# EAGLE schematic RelayBoard (EAGLE 6.5.0)

## Sheet 1 of 5: Power
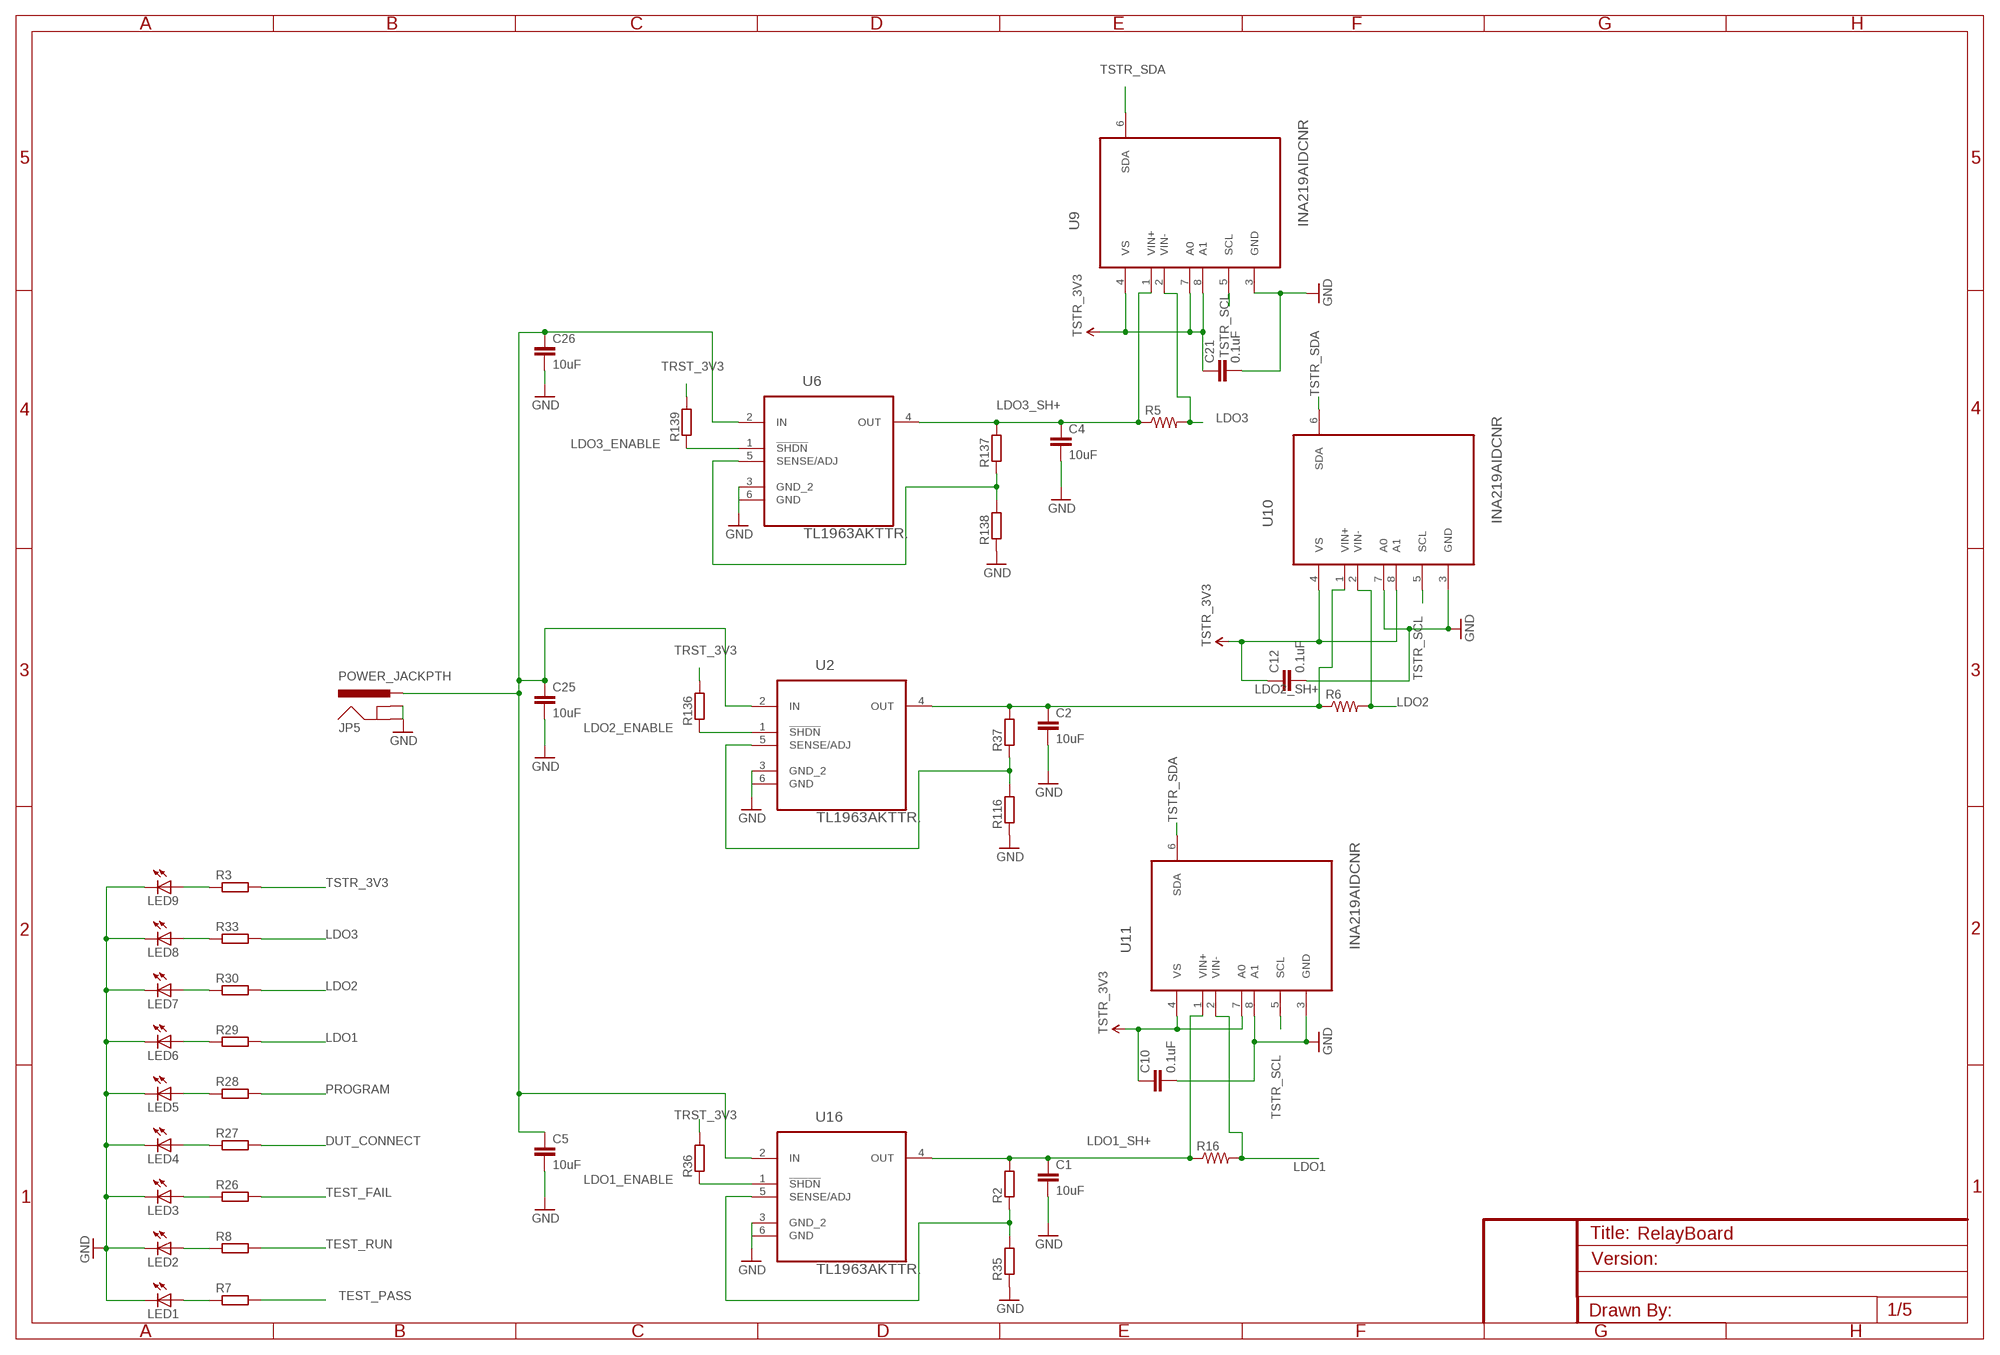
[diagram p0: schematic, sheet 1, part 1 of 2]
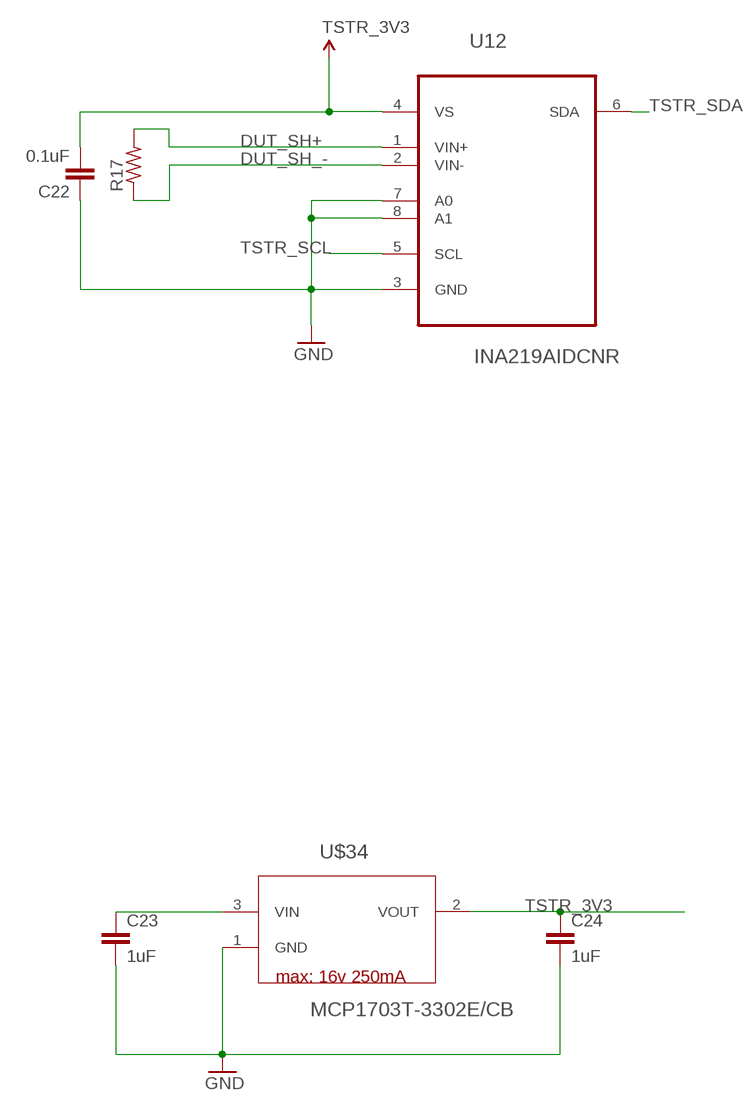
[diagram p1: schematic, sheet 1, part 2 of 2]

### Parts
C1  10uF  C-EUC0402  [C0402]
C2  10uF  C-EUC0402  [C0402]
C4  10uF  C-EUC0402  [C0402]
C5  10uF  C-EUC0402  [C0402]
C10  0.1uF  C-EUC0402  [C0402]
C12  0.1uF  C-EUC0402  [C0402]
C21  0.1uF  C-EUC0402  [C0402]
C22  0.1uF  C-EUC0402  [C0402]
C23  1uF  C-EUC0402  [C0402]
C24  1uF  C-EUC0402  [C0402]
C25  10uF  C-EUC0402  [C0402]
C26  10uF  C-EUC0402  [C0402]
JP5  POWER_JACKPTH  [POWER_JACK_PTH]
LED1  LEDCHIP-LED0805  [CHIP-LED0805]
LED2  LEDCHIP-LED0805  [CHIP-LED0805]
LED3  LEDCHIP-LED0805  [CHIP-LED0805]
LED4  LEDCHIP-LED0805  [CHIP-LED0805]
LED5  LEDCHIP-LED0805  [CHIP-LED0805]
LED6  LEDCHIP-LED0805  [CHIP-LED0805]
LED7  LEDCHIP-LED0805  [CHIP-LED0805]
LED8  LEDCHIP-LED0805  [CHIP-LED0805]
LED9  LEDCHIP-LED0805  [CHIP-LED0805]
R2  R-EU_R0402  [R0402]
R3  R-EU_R0402  [R0402]
R5  R-US_R5025  [R5025]
R6  R-US_R5025  [R5025]
R7  R-EU_R0402  [R0402]
R8  R-EU_R0402  [R0402]
R16  R-US_R5025  [R5025]
R17  R-US_R5025  [R5025]
R26  R-EU_R0402  [R0402]
R27  R-EU_R0402  [R0402]
R28  R-EU_R0402  [R0402]
R29  R-EU_R0402  [R0402]
R30  R-EU_R0402  [R0402]
R33  R-EU_R0402  [R0402]
R35  R-EU_R0402  [R0402]
R36  R-EU_R0402  [R0402]
R37  R-EU_R0402  [R0402]
R116  R-EU_R0402  [R0402]
R136  R-EU_R0402  [R0402]
R137  R-EU_R0402  [R0402]
R138  R-EU_R0402  [R0402]
R139  R-EU_R0402  [R0402]
U2  TL1963AKTTR.  [TO170P1485X457-6N]
U6  TL1963AKTTR.  [TO170P1485X457-6N]
U9  INA219AIDCNR  [SOT65P280X145-8N]
U10  INA219AIDCNR  [SOT65P280X145-8N]
U11  INA219AIDCNR  [SOT65P280X145-8N]
U12  INA219AIDCNR  [SOT65P280X145-8N]
U16  TL1963AKTTR.  [TO170P1485X457-6N]
U$34  MCP1703T-3302E/CB  [SOT95P300X145-3N]

### Nets
ADJ3: R2.1 R35.2 U16.5(SENSE/ADJ)
ADJ4: R37.1 R116.2 U2.5(SENSE/ADJ)
ADJ5: R137.1 R138.2 U6.5(SENSE/ADJ)
DUT_CONNECT: R27.2
DUT_SH+: R17.2 U12.1(VIN+)
DUT_SH_-: R17.1 U12.2(VIN-)
GND: C1.2 C2.2 C4.2 C5.2 C10.2 C12.2 C21.2 C22.1 C23.2 C24.2 C25.2 C26.2 JP5.GND JP5.GNDBREAK LED1.C LED2.C LED3.C LED4.C LED5.C LED6.C LED7.C LED8.C LED9.C R35.1 R116.1 R138.1 U2.3(GND_2) U2.6(GND) U6.3(GND_2) U6.6(GND) U9.3(GND) U10.3(GND) U10.7(A0) U11.3(GND) U11.8(A1) U12.3(GND) U12.7(A0) U12.8(A1) U16.3(GND_2) U16.6(GND) U$34.1(GND) ; also sheet 2,3,4,5
LDO1 [Power]: R16.2 R29.2 U11.2(VIN-) ; also sheet 3
LDO1_ENABLE: R36.1 U16.1(!SHDN)
LDO1_SH+ [Power]: C1.1 R2.2 R16.1 U11.1(VIN+) U16.4(OUT)
LDO2 [Power]: R6.2 R30.2 U10.2(VIN-) ; also sheet 3
LDO2_ENABLE: R136.1 U2.1(!SHDN)
LDO2_SH+ [Power]: C2.1 R6.1 R37.2 U2.4(OUT) U10.1(VIN+)
LDO3 [Power]: R5.2 R33.2 U9.2(VIN-) ; also sheet 3
LDO3_ENABLE: R139.1 U6.1(!SHDN)
LDO3_SH+ [Power]: C4.1 R5.1 R137.2 U6.4(OUT) U9.1(VIN+)
N$3: LED2.A R8.1
N$5: LED1.A R7.1
N$23: LED3.A R26.1
N$25: LED4.A R27.1
N$33: LED5.A R28.1
N$34: LED6.A R29.1
N$35: LED7.A R30.1
N$36: LED8.A R33.1
N$110: LED9.A R3.1
N$216: C23.1 U$34.3(VIN)
POWER_IN: C5.1 C25.1 C26.1 JP5.PWR U2.2(IN) U6.2(IN) U16.2(IN)
PROGRAM: R28.2
TEST_FAIL: R26.2
TEST_PASS: R7.2
TEST_RUN: R8.2
TRST_3V3: R36.2 R136.2 R139.2
TSTR_3V3: C10.1 C12.1 C21.1 C22.2 C24.1 R3.2 U9.4(VS) U9.7(A0) U9.8(A1) U10.4(VS) U10.8(A1) U11.4(VS) U11.7(A0) U12.4(VS) U$34.2(VOUT) ; also sheet 2,4
TSTR_SCL: U9.5(SCL) U10.5(SCL) U11.5(SCL) U12.5(SCL)
TSTR_SDA: U9.6(SDA) U10.6(SDA) U11.6(SDA) U12.6(SDA)

### Notes on the sheet
- max: 16v 250mA

## Sheet 2 of 5: MCU
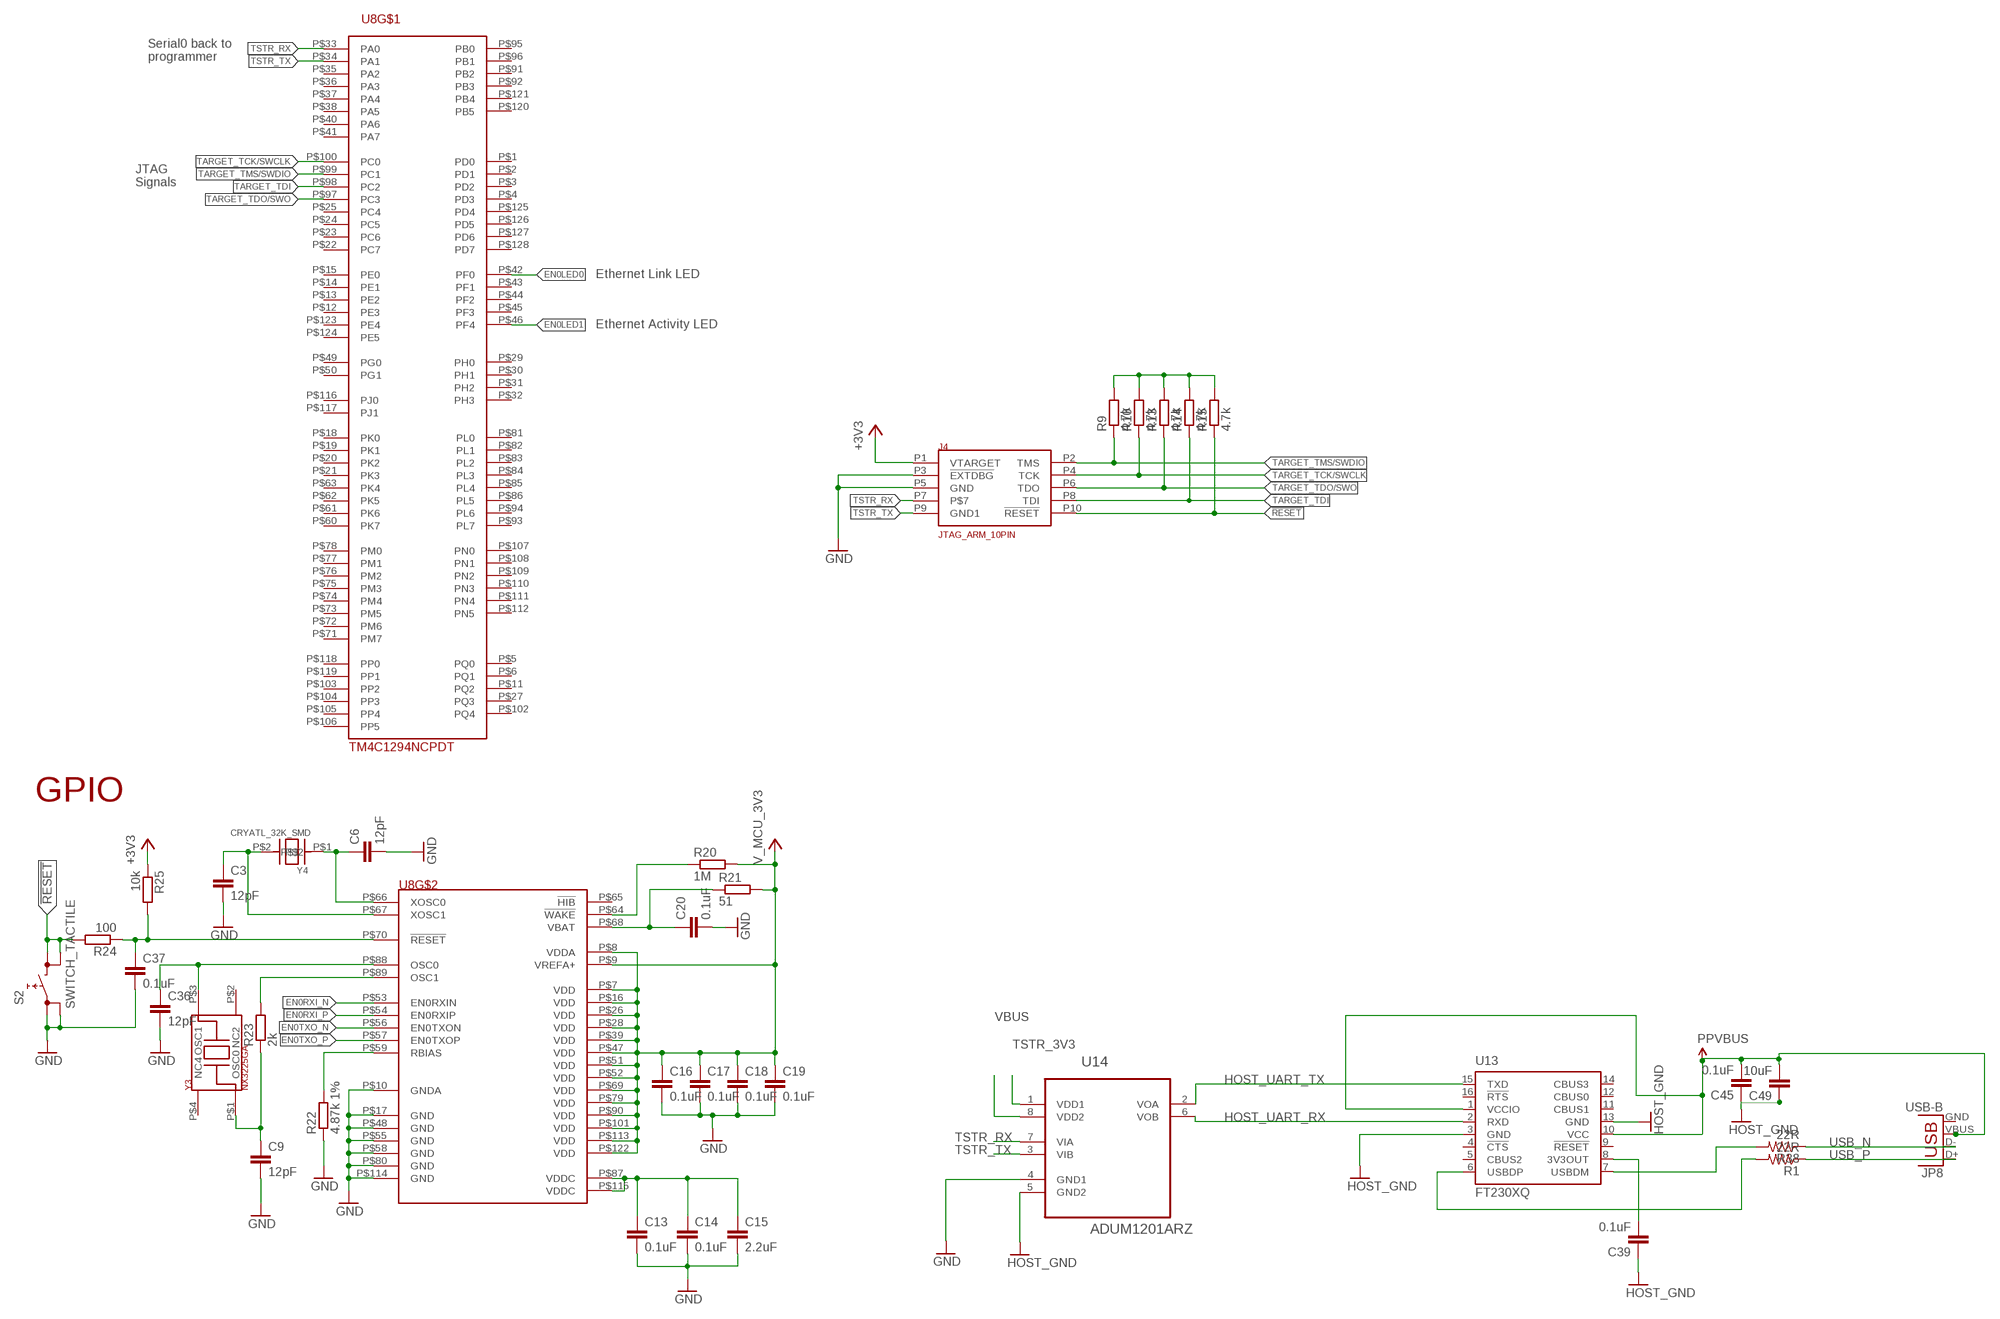
[diagram p2: schematic, sheet 2]

### Parts
C3  12pF  C-EUC0402K  [C0402K]
C6  12pF  C-EUC0402K  [C0402K]
C9  12pF  C-EUC0402K  [C0402K]
C13  0.1uF  C-EUC0402K  [C0402K]
C14  0.1uF  C-EUC0402K  [C0402K]
C15  2.2uF  C-EUC0402K  [C0402K]
C16  0.1uF  C-EUC0402K  [C0402K]
C17  0.1uF  C-EUC0402K  [C0402K]
C18  0.1uF  C-EUC0402K  [C0402K]
C19  0.1uF  C-EUC0402K  [C0402K]
C20  0.1uF  C-EUC0402K  [C0402K]
C36  12pF  C-EUC0402K  [C0402K]
C37  0.1uF  CC0402  [C0402]
C39  0.1uF  C-EUC0402  [C0402]
C45  0.1uF  C-EUC0402  [C0402]
C49  10uF  C-EUC0402  [C0402]
J4  JTAG_ARM_10PIN  [CON_2X5_50MIL]
JP8  USB-B  USBPTH  [USB-B-PTH]
R1  22R  RESISTOR0402-RES  [0402-RES]
R9  4.7k  R-EU_R0402  [R0402]
R10  4.7k  R-EU_R0402  [R0402]
R13  4.7k  R-EU_R0402  [R0402]
R14  4.7k  R-EU_R0402  [R0402]
R15  4.7k  R-EU_R0402  [R0402]
R20  1M  R-EU_R0402  [R0402]
R21  51  R-EU_R0402  [R0402]
R22  4.87k 1%  R-EU_R0402  [R0402]
R23  2k  R-EU_R0402  [R0402]
R24  100  R-EU_R0402  [R0402]
R25  10k  R-EU_R0402  [R0402]
R38  22R  RESISTOR0402-RES  [0402-RES]
S2  SWITCH_TACTILE  [SWITCH_6MM_6MM_TE_CON_SMD]
U8  TM4C1294NCPDT  [TQFP-128]
U13  FT230XQ  [QFN16]
U14  ADUM1201ARZ  [SOIC127P600X175-8N]
Y3  NX3225GA  [NDK3.2X2.5]
Y4  CRYATL_32K_SMD  [CRYSTAL_32K_SMD]

### Nets
!RESET: J4.P10(!RESET) R15.1 R24.2 S2.P$3 S2.P$4
EN0LED0: U8.P$42(PF0)
EN0LED1: U8.P$46(PF4)
EN0RXI_N [Ethernet]: U8.P$53(EN0RXIN)
EN0RXI_P [Ethernet]: U8.P$54(EN0RXIP)
EN0TXO_N [Ethernet]: U8.P$56(EN0TXON)
EN0TXO_P [Ethernet]: U8.P$57(EN0TXOP)
GND: C3.2 C6.2 C9.2 C13.2 C14.2 C15.2 C16.2 C17.2 C18.2 C19.2 C20.2 C36.2 C37.2 J4.P3(!EXTDBG) J4.P5(GND) R22.1 S2.P$1 S2.P$2 U8.P$10(GNDA) U8.P$17(GND) U8.P$48(GND) U8.P$55(GND) U8.P$58(GND) U8.P$80(GND) U8.P$114(GND) U14.4(GND1) ; also sheet 1,3,4,5
HOST_GND: C39.1 C45.1 C49.1 U13.3(GND) U13.13(GND) U14.5(GND2)
HOST_UART_RX: U13.2(RXD) U14.6(VOB)
HOST_UART_TX: U13.15(TXD) U14.2(VOA)
N$2: R9.2 R10.2 R13.2 R14.2 R15.2
N$159: C39.2 U13.8(3V3OUT)
N_$2: C20.1 R21.1 U8.P$68(VBAT)
N_$24: R20.1 U8.P$64(!WAKE)
N_$28: C13.1 C14.1 C15.1 U8.P$87(VDDC) U8.P$115(VDDC)
N_$29: R22.2 U8.P$59(RBIAS)
N_$30: R23.2 U8.P$89(OSC1)
N_$31: C36.1 U8.P$88(OSC0) Y3.P$3(OSC1)
N_$32: C9.1 R23.1 Y3.P$1(OSC0)
N_$33: C37.1 R24.1 R25.2 U8.P$70(!RESET)
N_$34: C6.1 U8.P$66(XOSC0) Y4.P$1
N_$35: C3.1 U8.P$67(XOSC1) Y4.P$2
TARGET_TCK/SWCLK: J4.P4(TCK) R10.1 U8.P$100(PC0)
TARGET_TDI: J4.P8(TDI) R14.1 U8.P$98(PC2)
TARGET_TDO/SWO: J4.P6(TDO) R13.1 U8.P$97(PC3)
TARGET_TMS/SWDIO: J4.P2(TMS) R9.1 U8.P$99(PC1)
TSTR_3V3: C16.1 C17.1 C18.1 C19.1 J4.P1(VTARGET) R20.2 R21.2 R25.1 U8.P$7(VDD) U8.P$8(VDDA) U8.P$9(VREFA+) U8.P$16(VDD) U8.P$26(VDD) U8.P$28(VDD) U8.P$39(VDD) U8.P$47(VDD) U8.P$51(VDD) U8.P$52(VDD) U8.P$69(VDD) U8.P$79(VDD) U8.P$90(VDD) U8.P$101(VDD) U8.P$113(VDD) U8.P$122(VDD) U14.1(VDD1) ; supply symbol labelled V_MCU_3V3, +3V3 ; also sheet 1,4
TSTR_RX: J4.P7 U8.P$33(PA0) U14.7(VIA) ; also sheet 4
TSTR_TX: J4.P9(GND1) U8.P$34(PA1) U14.3(VIB) ; also sheet 4
USB_N: JP8.D- R38.1
USB_P: JP8.D+ R1.1
USBD_N: R38.2 U13.7(USBDM)
USBD_P: R1.2 U13.6(USBDP)
VBUS: C45.2 C49.2 JP8.VBUS U13.1(VCCIO) U13.10(VCC) U14.8(VDD2) ; supply symbol labelled PPVBUS
Unconnected: JP8.GND U8.P$1(PD0) U8.P$2(PD1) U8.P$3(PD2) U8.P$4(PD3) U8.P$5(PQ0) U8.P$6(PQ1) U8.P$11(PQ2) U8.P$12(PE3) U8.P$13(PE2) U8.P$14(PE1) U8.P$15(PE0) U8.P$18(PK0) U8.P$19(PK1) U8.P$20(PK2) U8.P$21(PK3) U8.P$22(PC7) U8.P$23(PC6) U8.P$24(PC5) U8.P$25(PC4) U8.P$27(PQ3) U8.P$29(PH0) U8.P$30(PH1) U8.P$31(PH2) U8.P$32(PH3) U8.P$35(PA2) U8.P$36(PA3) U8.P$37(PA4) U8.P$38(PA5) U8.P$40(PA6) U8.P$41(PA7) U8.P$43(PF1) U8.P$44(PF2) U8.P$45(PF3) U8.P$49(PG0) U8.P$50(PG1) U8.P$60(PK7) U8.P$61(PK6) U8.P$62(PK5) U8.P$63(PK4) U8.P$65(!HIB) U8.P$71(PM7) U8.P$72(PM6) U8.P$73(PM5) U8.P$74(PM4) U8.P$75(PM3) U8.P$76(PM2) U8.P$77(PM1) U8.P$78(PM0) U8.P$81(PL0) U8.P$82(PL1) U8.P$83(PL2) U8.P$84(PL3) U8.P$85(PL4) U8.P$86(PL5) U8.P$91(PB2) U8.P$92(PB3) U8.P$93(PL7) U8.P$94(PL6) U8.P$95(PB0) U8.P$96(PB1) U8.P$102(PQ4) U8.P$103(PP2) U8.P$104(PP3) U8.P$105(PP4) U8.P$106(PP5) U8.P$107(PN0) U8.P$108(PN1) U8.P$109(PN2) U8.P$110(PN3) U8.P$111(PN4) U8.P$112(PN5) U8.P$116(PJ0) U8.P$117(PJ1) U8.P$118(PP0) U8.P$119(PP1) U8.P$120(PB5) U8.P$121(PB4) U8.P$123(PE4) U8.P$124(PE5) U8.P$125(PD4) U8.P$126(PD5) U8.P$127(PD6) U8.P$128(PD7) U13.4(!CTS) U13.5(CBUS2) U13.9(!RESET) U13.11(CBUS1) U13.12(CBUS0) U13.14(CBUS3) U13.16(!RTS) Y3.P$2(NC2) Y3.P$4(NC4)

### Notes on the sheet
- Serial0 back to
  programmer
- JTAG
  Signals
- Ethernet Link LED
- Ethernet Activity LED
- GPIO

## Sheet 3 of 5: DUT_Connector
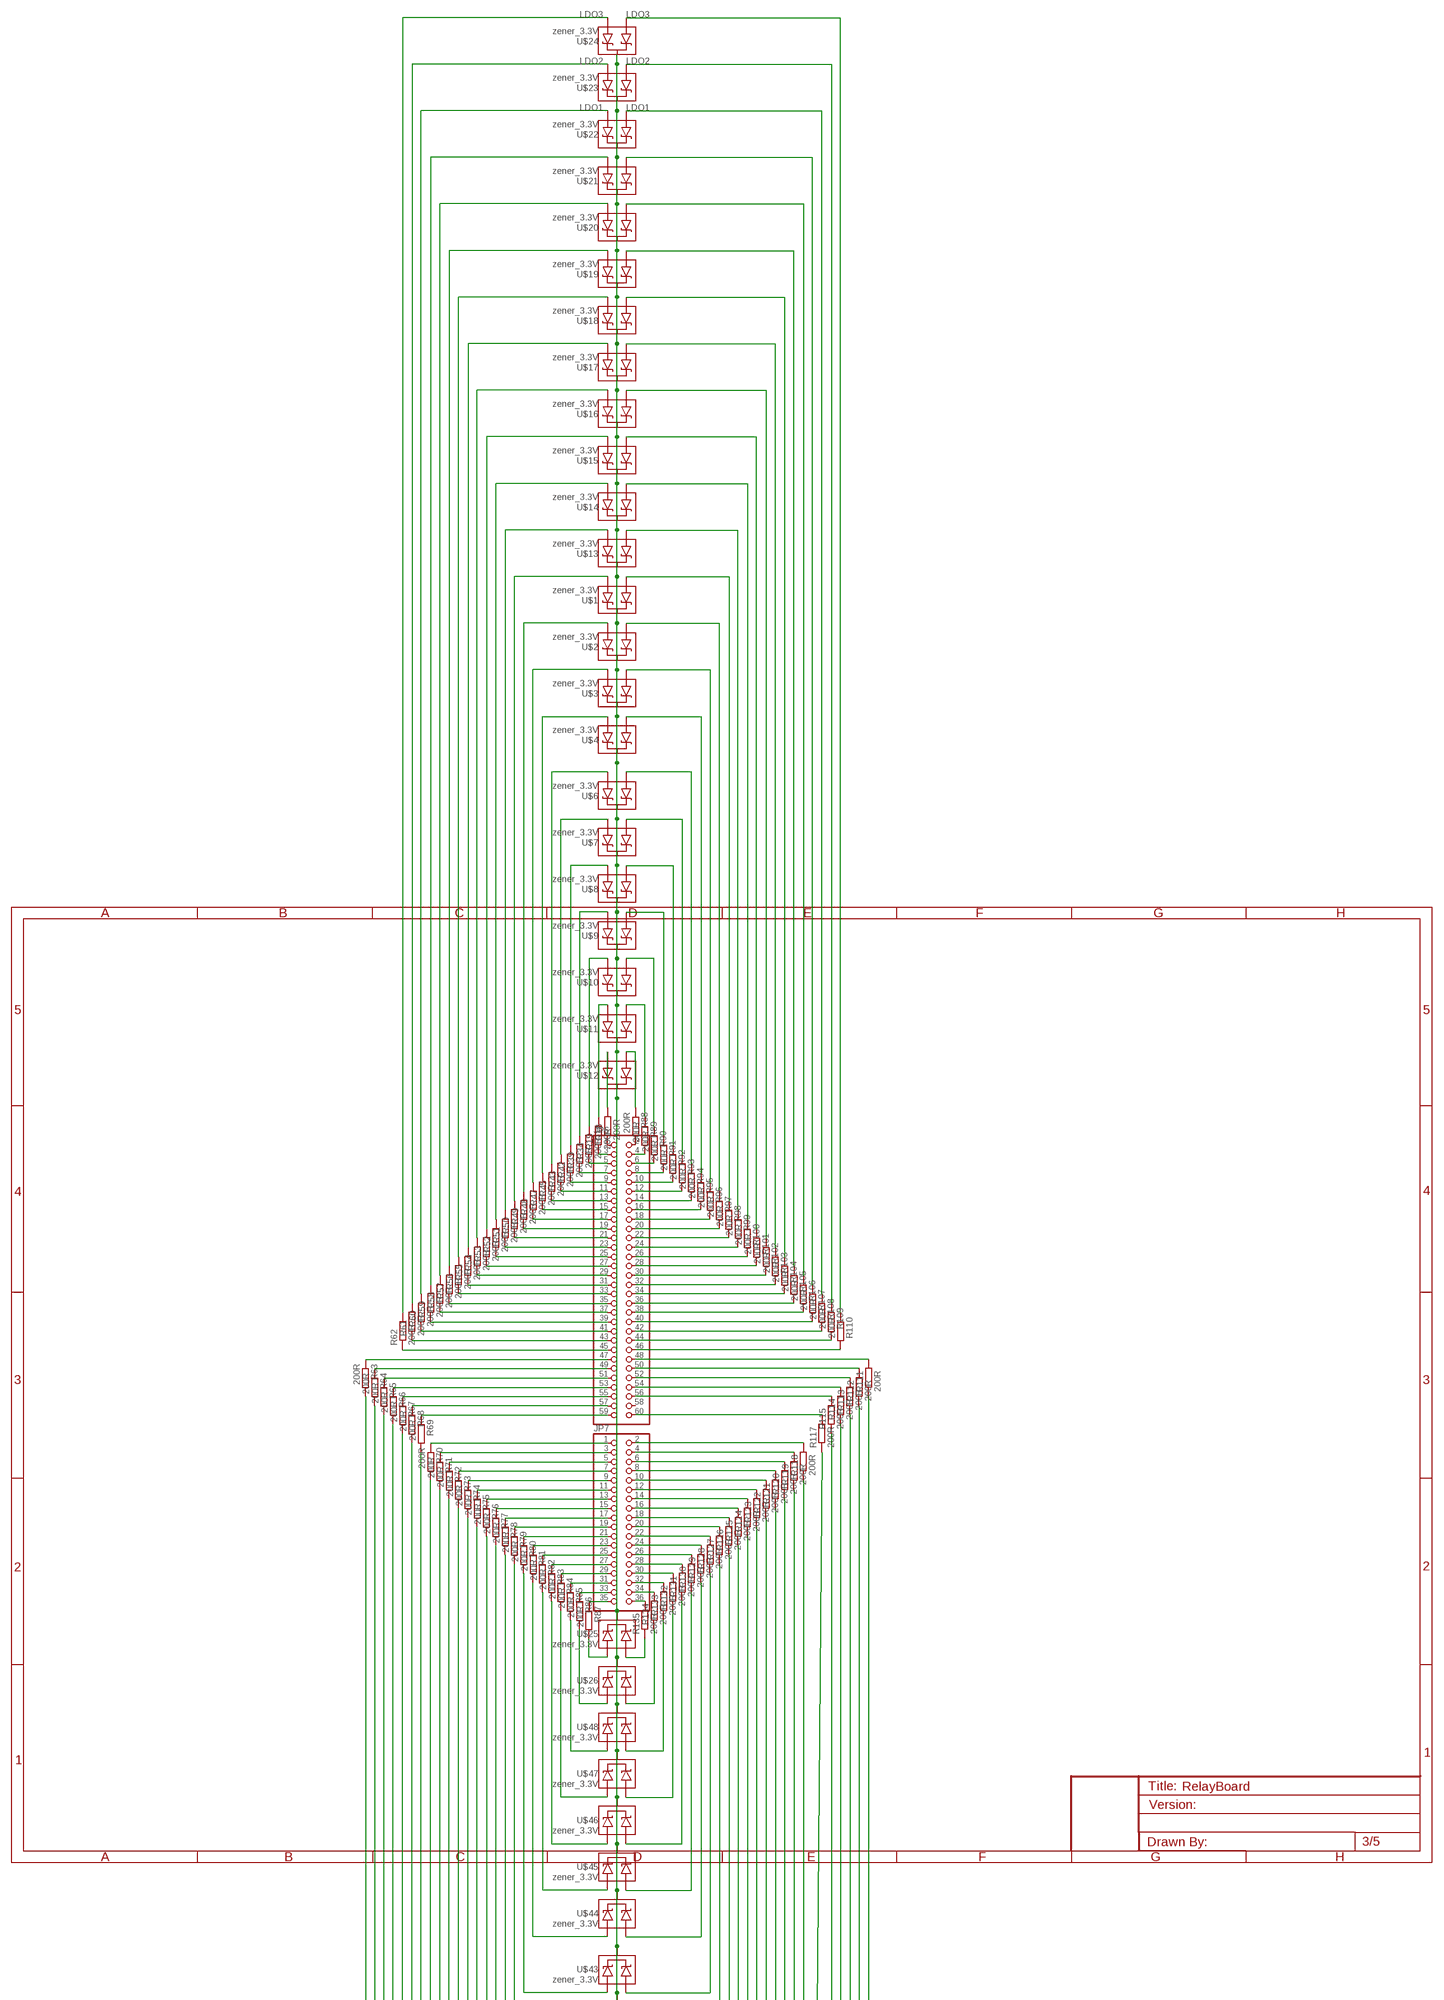
[diagram p3: schematic, sheet 3, part 1 of 2]
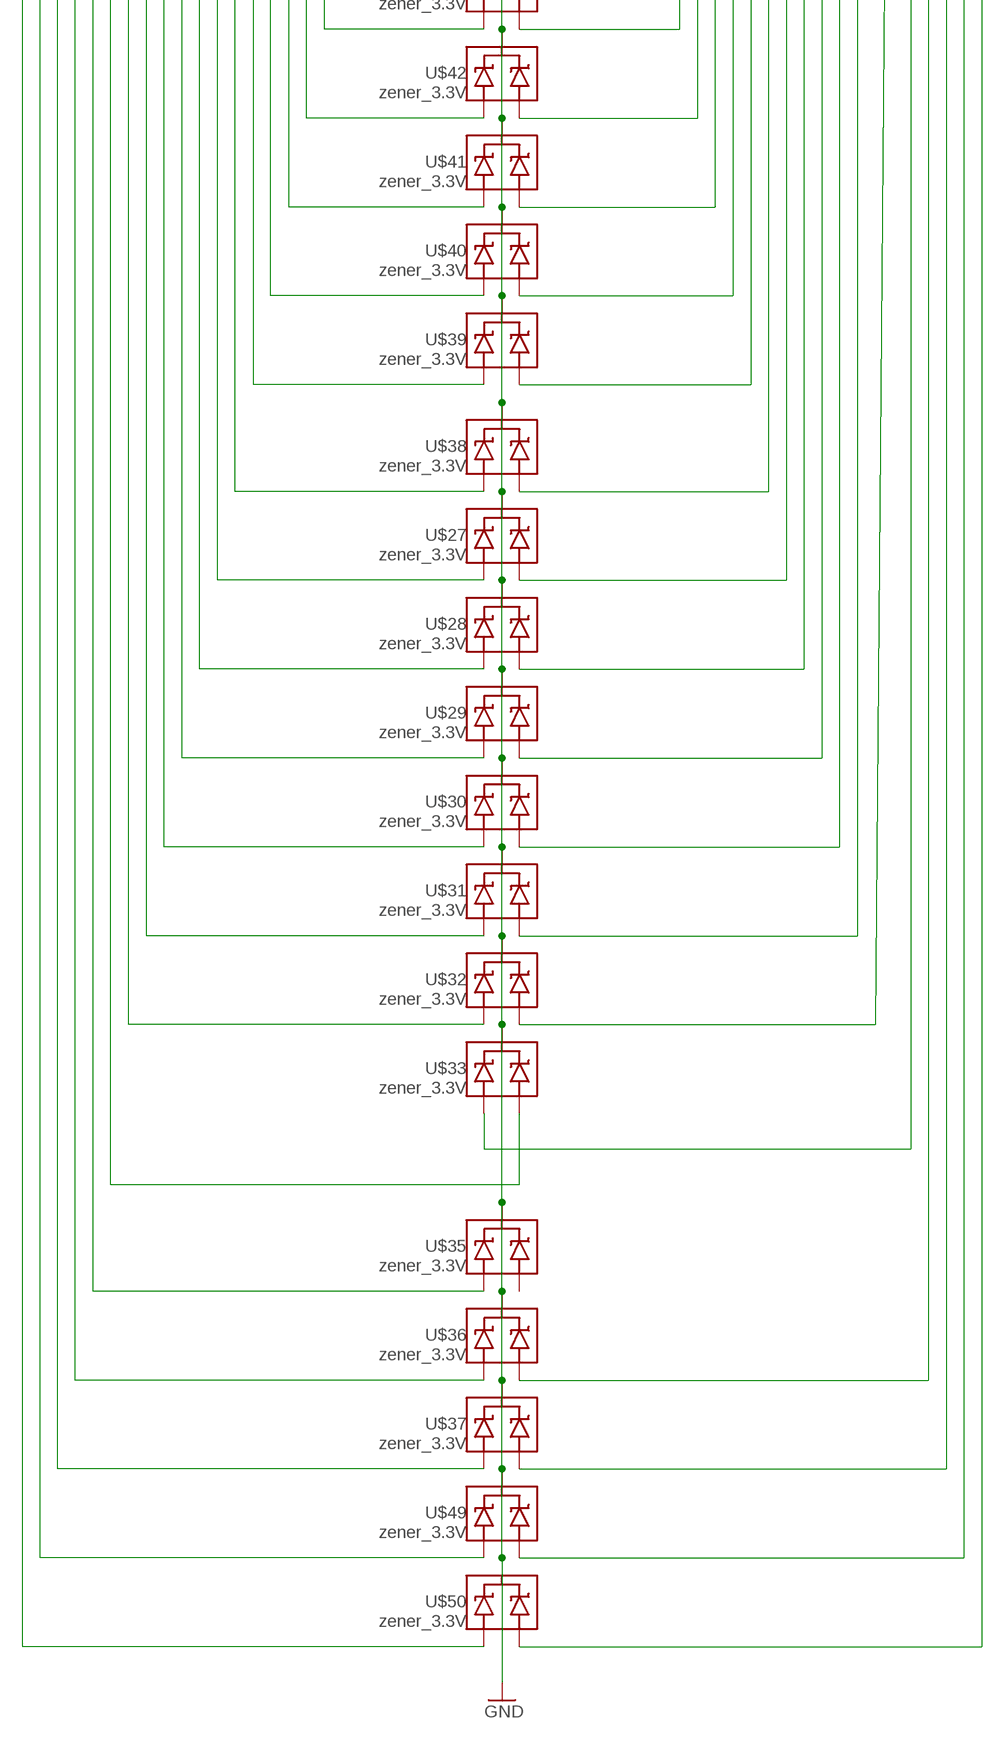
[diagram p4: schematic, sheet 3, part 2 of 2]

### Parts
JP6  PINHD-2X30  [2X30]
JP7  PINHD-2X18  [2X18]
R18  200R  R-EU_R0402  [R0402]
R19  200R  R-EU_R0402  [R0402]
R34  200R  R-EU_R0402  [R0402]
R39  200R  R-EU_R0402  [R0402]
R42  200R  R-EU_R0402  [R0402]
R43  200R  R-EU_R0402  [R0402]
R45  200R  R-EU_R0402  [R0402]
R47  200R  R-EU_R0402  [R0402]
R48  200R  R-EU_R0402  [R0402]
R49  200R  R-EU_R0402  [R0402]
R50  200R  R-EU_R0402  [R0402]
R51  200R  R-EU_R0402  [R0402]
R52  200R  R-EU_R0402  [R0402]
R53  200R  R-EU_R0402  [R0402]
R54  200R  R-EU_R0402  [R0402]
R55  200R  R-EU_R0402  [R0402]
R56  200R  R-EU_R0402  [R0402]
R57  200R  R-EU_R0402  [R0402]
R58  200R  R-EU_R0402  [R0402]
R59  200R  R-EU_R0402  [R0402]
R60  200R  R-EU_R0402  [R0402]
R61  200R  R-EU_R0402  [R0402]
R62  200R  R-EU_R0402  [R0402]
R63  200R  R-EU_R0402  [R0402]
R64  200R  R-EU_R0402  [R0402]
R65  200R  R-EU_R0402  [R0402]
R66  200R  R-EU_R0402  [R0402]
R67  200R  R-EU_R0402  [R0402]
R68  200R  R-EU_R0402  [R0402]
R69  200R  R-EU_R0402  [R0402]
R70  200R  R-EU_R0402  [R0402]
R71  200R  R-EU_R0402  [R0402]
R72  200R  R-EU_R0402  [R0402]
R73  200R  R-EU_R0402  [R0402]
R74  200R  R-EU_R0402  [R0402]
R75  200R  R-EU_R0402  [R0402]
R76  200R  R-EU_R0402  [R0402]
R77  200R  R-EU_R0402  [R0402]
R78  200R  R-EU_R0402  [R0402]
R79  200R  R-EU_R0402  [R0402]
R80  200R  R-EU_R0402  [R0402]
R81  200R  R-EU_R0402  [R0402]
R82  200R  R-EU_R0402  [R0402]
R83  200R  R-EU_R0402  [R0402]
R84  200R  R-EU_R0402  [R0402]
R85  200R  R-EU_R0402  [R0402]
R86  200R  R-EU_R0402  [R0402]
R87  200R  R-EU_R0402  [R0402]
R88  200R  R-EU_R0402  [R0402]
R89  200R  R-EU_R0402  [R0402]
R90  200R  R-EU_R0402  [R0402]
R91  200R  R-EU_R0402  [R0402]
R92  200R  R-EU_R0402  [R0402]
R93  200R  R-EU_R0402  [R0402]
R94  200R  R-EU_R0402  [R0402]
R95  200R  R-EU_R0402  [R0402]
R96  200R  R-EU_R0402  [R0402]
R97  200R  R-EU_R0402  [R0402]
R98  200R  R-EU_R0402  [R0402]
R99  200R  R-EU_R0402  [R0402]
R100  200R  R-EU_R0402  [R0402]
R101  200R  R-EU_R0402  [R0402]
R102  200R  R-EU_R0402  [R0402]
R103  200R  R-EU_R0402  [R0402]
R104  200R  R-EU_R0402  [R0402]
R105  200R  R-EU_R0402  [R0402]
R106  200R  R-EU_R0402  [R0402]
R107  200R  R-EU_R0402  [R0402]
R108  200R  R-EU_R0402  [R0402]
R109  200R  R-EU_R0402  [R0402]
R110  200R  R-EU_R0402  [R0402]
R111  200R  R-EU_R0402  [R0402]
R112  200R  R-EU_R0402  [R0402]
R113  200R  R-EU_R0402  [R0402]
R114  200R  R-EU_R0402  [R0402]
R115  200R  R-EU_R0402  [R0402]
R117  200R  R-EU_R0402  [R0402]
R118  200R  R-EU_R0402  [R0402]
R119  200R  R-EU_R0402  [R0402]
R120  200R  R-EU_R0402  [R0402]
R121  200R  R-EU_R0402  [R0402]
R122  200R  R-EU_R0402  [R0402]
R123  200R  R-EU_R0402  [R0402]
R124  200R  R-EU_R0402  [R0402]
R125  200R  R-EU_R0402  [R0402]
R126  200R  R-EU_R0402  [R0402]
R127  200R  R-EU_R0402  [R0402]
R128  200R  R-EU_R0402  [R0402]
R129  200R  R-EU_R0402  [R0402]
R130  200R  R-EU_R0402  [R0402]
R131  200R  R-EU_R0402  [R0402]
R132  200R  R-EU_R0402  [R0402]
R133  200R  R-EU_R0402  [R0402]
R134  200R  R-EU_R0402  [R0402]
R135  200R  R-EU_R0402  [R0402]
U$1  zener_3.3V  MMBZ27VCLT1  [SOT23-3]
U$2  zener_3.3V  MMBZ27VCLT1  [SOT23-3]
U$3  zener_3.3V  MMBZ27VCLT1  [SOT23-3]
U$4  zener_3.3V  MMBZ27VCLT1  [SOT23-3]
U$6  zener_3.3V  MMBZ27VCLT1  [SOT23-3]
U$7  zener_3.3V  MMBZ27VCLT1  [SOT23-3]
U$8  zener_3.3V  MMBZ27VCLT1  [SOT23-3]
U$9  zener_3.3V  MMBZ27VCLT1  [SOT23-3]
U$10  zener_3.3V  MMBZ27VCLT1  [SOT23-3]
U$11  zener_3.3V  MMBZ27VCLT1  [SOT23-3]
U$12  zener_3.3V  MMBZ27VCLT1  [SOT23-3]
U$13  zener_3.3V  MMBZ27VCLT1  [SOT23-3]
U$14  zener_3.3V  MMBZ27VCLT1  [SOT23-3]
U$15  zener_3.3V  MMBZ27VCLT1  [SOT23-3]
U$16  zener_3.3V  MMBZ27VCLT1  [SOT23-3]
U$17  zener_3.3V  MMBZ27VCLT1  [SOT23-3]
U$18  zener_3.3V  MMBZ27VCLT1  [SOT23-3]
U$19  zener_3.3V  MMBZ27VCLT1  [SOT23-3]
U$20  zener_3.3V  MMBZ27VCLT1  [SOT23-3]
U$21  zener_3.3V  MMBZ27VCLT1  [SOT23-3]
U$22  zener_3.3V  MMBZ27VCLT1  [SOT23-3]
U$23  zener_3.3V  MMBZ27VCLT1  [SOT23-3]
U$24  zener_3.3V  MMBZ27VCLT1  [SOT23-3]
U$25  zener_3.3V  MMBZ27VCLT1  [SOT23-3]
U$26  zener_3.3V  MMBZ27VCLT1  [SOT23-3]
U$27  zener_3.3V  MMBZ27VCLT1  [SOT23-3]
U$28  zener_3.3V  MMBZ27VCLT1  [SOT23-3]
U$29  zener_3.3V  MMBZ27VCLT1  [SOT23-3]
U$30  zener_3.3V  MMBZ27VCLT1  [SOT23-3]
U$31  zener_3.3V  MMBZ27VCLT1  [SOT23-3]
U$32  zener_3.3V  MMBZ27VCLT1  [SOT23-3]
U$33  zener_3.3V  MMBZ27VCLT1  [SOT23-3]
U$35  zener_3.3V  MMBZ27VCLT1  [SOT23-3]
U$36  zener_3.3V  MMBZ27VCLT1  [SOT23-3]
U$37  zener_3.3V  MMBZ27VCLT1  [SOT23-3]
U$38  zener_3.3V  MMBZ27VCLT1  [SOT23-3]
U$39  zener_3.3V  MMBZ27VCLT1  [SOT23-3]
U$40  zener_3.3V  MMBZ27VCLT1  [SOT23-3]
U$41  zener_3.3V  MMBZ27VCLT1  [SOT23-3]
U$42  zener_3.3V  MMBZ27VCLT1  [SOT23-3]
U$43  zener_3.3V  MMBZ27VCLT1  [SOT23-3]
U$44  zener_3.3V  MMBZ27VCLT1  [SOT23-3]
U$45  zener_3.3V  MMBZ27VCLT1  [SOT23-3]
U$46  zener_3.3V  MMBZ27VCLT1  [SOT23-3]
U$47  zener_3.3V  MMBZ27VCLT1  [SOT23-3]
U$48  zener_3.3V  MMBZ27VCLT1  [SOT23-3]
U$49  zener_3.3V  MMBZ27VCLT1  [SOT23-3]
U$50  zener_3.3V  MMBZ27VCLT1  [SOT23-3]

### Nets
GND: U$1.3(C) U$2.3(C) U$3.3(C) U$4.3(C) U$6.3(C) U$7.3(C) U$8.3(C) U$9.3(C) U$10.3(C) U$11.3(C) U$12.3(C) U$13.3(C) U$14.3(C) U$15.3(C) U$16.3(C) U$17.3(C) U$18.3(C) U$19.3(C) U$20.3(C) U$21.3(C) U$22.3(C) U$23.3(C) U$24.3(C) U$25.3(C) U$26.3(C) U$27.3(C) U$28.3(C) U$29.3(C) U$30.3(C) U$31.3(C) U$32.3(C) U$33.3(C) U$35.3(C) U$36.3(C) U$37.3(C) U$38.3(C) U$39.3(C) U$40.3(C) U$41.3(C) U$42.3(C) U$43.3(C) U$44.3(C) U$45.3(C) U$46.3(C) U$47.3(C) U$48.3(C) U$49.3(C) U$50.3(C) ; also sheet 1,2,4,5
LDO1 [Power]: R60.2 R108.1 U$22.1(A1) U$22.2(A2) ; also sheet 1
LDO2 [Power]: R61.2 R109.1 U$23.1(A1) U$23.2(A2) ; also sheet 1
LDO3 [Power]: R62.2 R110.1 U$24.1(A1) U$24.2(A2) ; also sheet 1
N$4: JP6.1 R18.1
N$6: JP6.3 R19.1
N$7: JP6.5 R34.1
N$8: JP6.7 R39.1
N$9: JP6.9 R42.1
N$10: JP6.11 R43.1
N$11: JP6.13 R45.1
N$12: JP6.15 R47.1
N$13: JP6.17 R48.1
N$14: JP6.19 R49.1
N$15: JP6.21 R50.1
N$16: JP6.23 R51.1
N$17: JP6.25 R52.1
N$18: JP6.27 R53.1
N$19: JP6.29 R54.1
N$20: JP6.31 R55.1
N$21: JP6.33 R56.1
N$22: JP6.35 R57.1
N$24: JP6.37 R58.1
N$26: JP6.39 R59.1
N$27: JP6.41 R60.1
N$28: JP6.43 R61.1
N$29: JP6.45 R62.1
N$30: JP6.47 R63.1
N$31: JP6.49 R64.1
N$32: JP6.51 R65.1
N$37: JP6.53 R66.1
N$38: JP6.55 R67.1
N$39: JP6.57 R68.1
N$40: JP6.59 R69.1
N$41: JP7.1 R70.1
N$42: JP7.3 R71.1
N$43: JP7.5 R72.1
N$49: JP7.7 R73.1
N$50: JP7.9 R74.1
N$51: JP7.11 R75.1
N$52: JP7.13 R76.1
N$53: JP7.15 R77.1
N$54: JP7.17 R78.1
N$55: JP7.19 R79.1
N$56: JP7.21 R80.1
N$57: JP7.23 R81.1
N$58: JP7.25 R82.1
N$59: JP7.27 R83.1
N$60: JP7.29 R84.1
N$61: JP7.31 R85.1
N$62: JP7.33 R86.1
N$63: JP7.35 R87.1
N$64: JP7.2 R118.2
N$65: JP7.4 R119.2
N$66: JP7.6 R120.2
N$67: JP7.8 R121.2
N$68: JP7.10 R122.2
N$69: JP7.12 R123.2
N$70: JP7.14 R124.2
N$71: JP7.16 R125.2
N$72: JP7.18 R126.2
N$73: JP7.20 R127.2
N$74: JP7.22 R128.2
N$75: JP7.24 R129.2
N$76: JP7.26 R130.2
N$77: JP7.28 R131.2
N$78: JP7.30 R132.2
N$79: JP7.32 R133.2
N$80: JP7.34 R134.2
N$81: JP7.36 R135.2
N$82: JP6.2 R88.2
N$83: JP6.4 R89.2
N$84: JP6.6 R90.2
N$85: JP6.8 R91.2
N$86: JP6.10 R92.2
N$87: JP6.12 R93.2
N$88: JP6.14 R94.2
N$89: JP6.16 R95.2
N$90: JP6.18 R96.2
N$91: JP6.20 R97.2
N$92: JP6.22 R98.2
N$93: JP6.24 R99.2
N$94: JP6.26 R100.2
N$95: JP6.28 R101.2
N$96: JP6.30 R102.2
N$97: JP6.32 R103.2
N$98: JP6.34 R104.2
N$99: JP6.36 R105.2
N$100: JP6.38 R106.2
N$101: JP6.40 R107.2
N$102: JP6.42 R108.2
N$103: JP6.44 R109.2
N$104: JP6.46 R110.2
N$105: JP6.48 R111.2
N$106: JP6.50 R112.2
N$107: JP6.52 R113.2
N$108: JP6.54 R114.2
N$109: JP6.56 R115.2
N$111: JP6.60 R117.2
N$112: R18.2 U$12.2(A2)
N$113: R87.2 U$25.2(A2)
N$114: R88.1 U$12.1(A1)
N$115: R89.1 U$11.1(A1)
N$116: R19.2 U$11.2(A2)
N$117: R90.1 U$10.1(A1)
N$118: R34.2 U$10.2(A2)
N$119: R91.1 U$9.1(A1)
N$120: R39.2 U$9.2(A2)
N$121: R92.1 U$8.1(A1)
N$122: R42.2 U$8.2(A2)
N$123: R43.2 U$7.2(A2)
N$124: R93.1 U$7.1(A1)
N$125: R94.1 U$6.1(A1)
N$126: R45.2 U$6.2(A2)
N$127: R47.2 U$4.2(A2)
N$128: R95.1 U$4.1(A1)
N$129: R96.1 U$3.1(A1)
N$130: R48.2 U$3.2(A2)
N$131: R97.1 U$2.1(A1)
N$132: R49.2 U$2.2(A2)
N$133: R50.2 U$1.2(A2)
N$134: R98.1 U$1.1(A1)
N$135: R99.1 U$13.1(A1)
N$136: R51.2 U$13.2(A2)
N$137: R52.2 U$14.2(A2)
N$138: R100.1 U$14.1(A1)
N$139: R101.1 U$15.1(A1)
N$140: R53.2 U$15.2(A2)
N$141: R54.2 U$16.2(A2)
N$142: R102.1 U$16.1(A1)
N$143: R55.2 U$17.2(A2)
N$144: R103.1 U$17.1(A1)
N$145: R104.1 U$18.1(A1)
N$146: R56.2 U$18.2(A2)
N$147: R105.1 U$19.1(A1)
N$148: R57.2 U$19.2(A2)
N$149: R106.1 U$20.1(A1)
N$150: R58.2 U$20.2(A2)
N$151: R59.2 U$21.2(A2)
N$152: R107.1 U$21.1(A1)
N$157: R135.1 U$25.1(A1)
N$160: R134.1 U$26.1(A1)
N$161: R86.2 U$26.2(A2)
N$162: R85.2 U$48.2(A2)
N$163: R133.1 U$48.1(A1)
N$164: R84.2 U$47.2(A2)
N$165: R83.2 U$46.2(A2)
N$166: R82.2 U$45.2(A2)
N$167: R81.2 U$44.2(A2)
N$168: R80.2 U$43.2(A2)
N$169: R79.2 U$42.2(A2)
N$170: R78.2 U$41.2(A2)
N$171: R77.2 U$40.2(A2)
N$172: R76.2 U$39.2(A2)
N$173: R75.2 U$38.2(A2)
N$174: R73.2 U$28.2(A2)
N$175: R72.2 U$29.2(A2)
N$176: R71.2 U$30.2(A2)
N$177: R70.2 U$31.2(A2)
N$178: R69.2 U$32.2(A2)
N$179: R68.2 U$33.1(A1)
N$180: R67.2 U$35.2(A2)
N$181: R66.2 U$36.2(A2)
N$182: R129.1 U$44.1(A1)
N$183: R132.1 U$47.1(A1)
N$184: R131.1 U$46.1(A1)
N$185: R130.1 U$45.1(A1)
N$186: R74.2 U$27.2(A2)
N$187: R128.1 U$43.1(A1)
N$188: R127.1 U$42.1(A1)
N$189: R65.2 U$37.2(A2)
N$190: R64.2 U$49.2(A2)
N$191: R63.2 U$50.2(A2)
N$192: R126.1 U$41.1(A1)
N$193: R125.1 U$40.1(A1)
N$194: R124.1 U$39.1(A1)
N$195: R123.1 U$38.1(A1)
N$196: R122.1 U$27.1(A1)
N$197: R121.1 U$28.1(A1)
N$198: R120.1 U$29.1(A1)
N$199: R119.1 U$30.1(A1)
N$200: R118.1 U$31.1(A1)
N$201: R117.1 U$32.1(A1)
N$203: R115.1 U$33.2(A2)
N$204: R114.1 U$36.1(A1)
N$205: R113.1 U$37.1(A1)
N$206: R112.1 U$49.1(A1)
N$207: R111.1 U$50.1(A1)
Unconnected: JP6.58 U$35.1(A1)

## Sheet 4 of 5: DUT interface
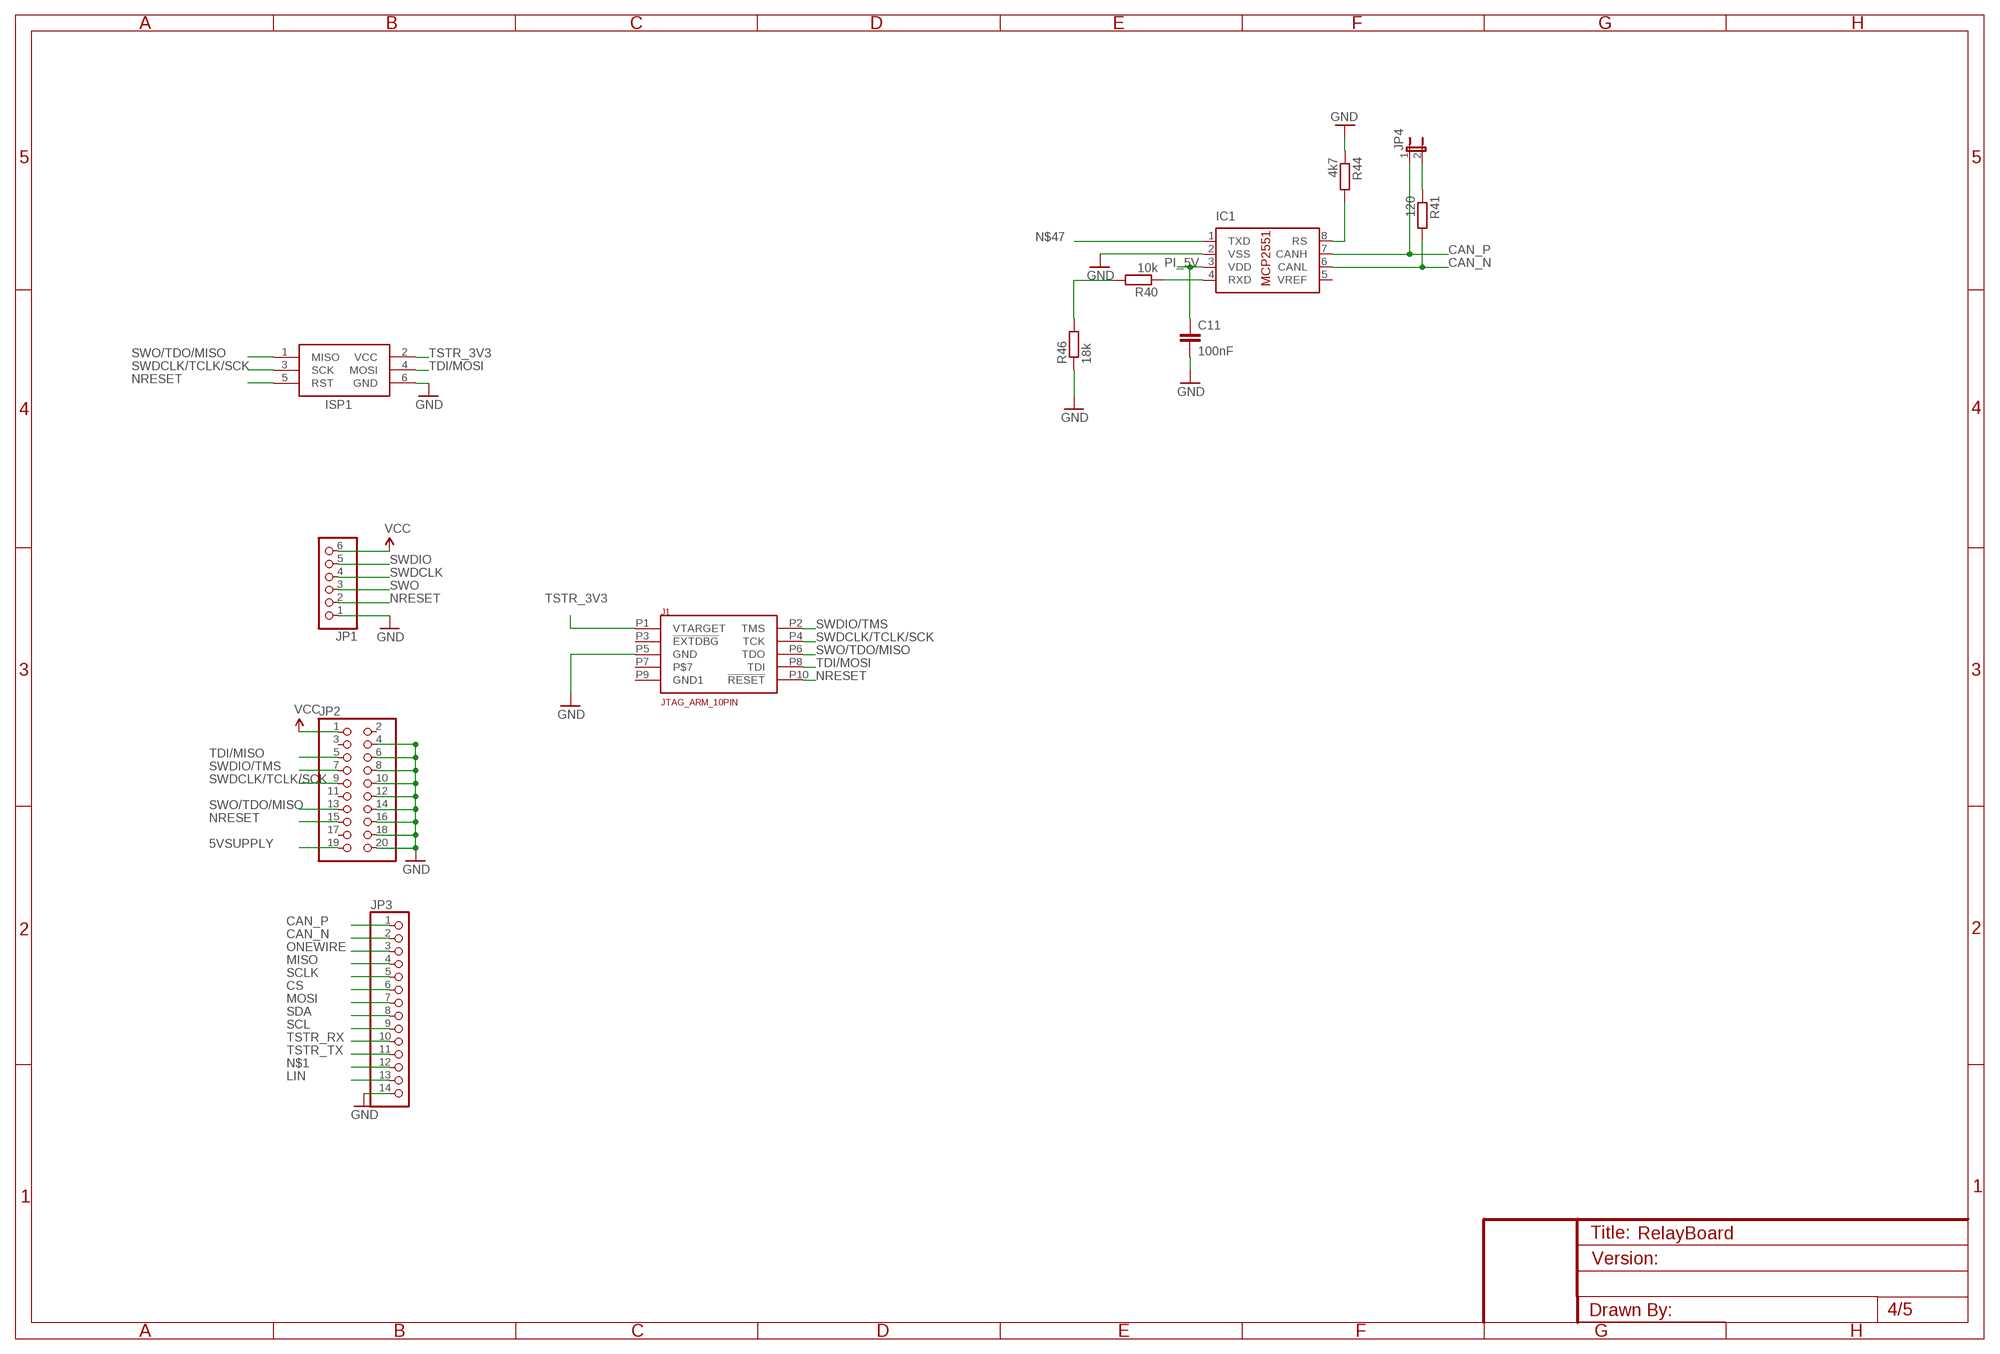
[diagram p5: schematic, sheet 4]

### Parts
C11  100nF  CC0402  [C0402]
IC1  MCP2551/SN RSC 402-904  MCP2551/SN  [SO08]
ISP1  AVRISP-6  [AVRISP]
J1  JTAG_ARM_10PIN  [CON_2X5_50MIL]
JP1  PINHD-1X6B  [1X06-BIG]
JP2  PINHD-2X10  [2X10]
JP3  PINHD-1X14  [1X14]
JP4  JUMPER-2SMD-NO  [SJ_2S-NO]
R40  10k  R-EU_R0402  [R0402]
R41  120  R-EU_R0402  [R0402]
R44  4k7  R-EU_R0402  [R0402]
R46  18k  R-EU_R0402  [R0402]

### Nets
5VSUPPLY: JP2.19
CAN_N: IC1.6(CANL) JP3.2 R41.2
CAN_P: IC1.7(CANH) JP3.1 JP4.1
CS: JP3.6
GND: C11.2 IC1.2(VSS) ISP1.6(GND) J1.P5(GND) JP1.1 JP2.4 JP2.6 JP2.8 JP2.10 JP2.12 JP2.14 JP2.16 JP2.18 JP2.20 JP3.14 R44.1 R46.1 ; also sheet 1,2,3,5
LIN: JP3.13
MISO: JP3.4
MOSI: JP3.7
N$1: JP3.12
N$44: JP4.2 R41.1
N$45: R40.2 R46.2
N$46: IC1.4(RXD) R40.1
N$47: IC1.1(TXD)
N$48: IC1.8(RS) R44.2
NRESET: ISP1.5(RST) J1.P10(!RESET) JP1.2 JP2.15
ONEWIRE: JP3.3
PI_5V: C11.1 IC1.3(VDD)
SCL: JP3.9
SCLK: JP3.5
SDA: JP3.8
SWDCLK: JP1.4
SWDCLK/TCLK/SCK: ISP1.3(SCK) J1.P4(TCK) JP2.9
SWDIO: JP1.5
SWDIO/TMS: J1.P2(TMS) JP2.7
SWO: JP1.3
SWO/TDO/MISO: ISP1.1(MISO) J1.P6(TDO) JP2.13
TDI/MISO: JP2.5
TDI/MOSI: ISP1.4(MOSI) J1.P8(TDI)
TSTR_3V3: ISP1.2(VCC) J1.P1(VTARGET) ; also sheet 1,2
TSTR_RX: JP3.10 ; also sheet 2
TSTR_TX: JP3.11 ; also sheet 2
VCC: JP1.6 JP2.1 ; also sheet 5
Unconnected: IC1.5(VREF) J1.P3(!EXTDBG) J1.P7 J1.P9(GND1) JP2.2 JP2.3 JP2.11 JP2.17

## Sheet 5 of 5: scope interface
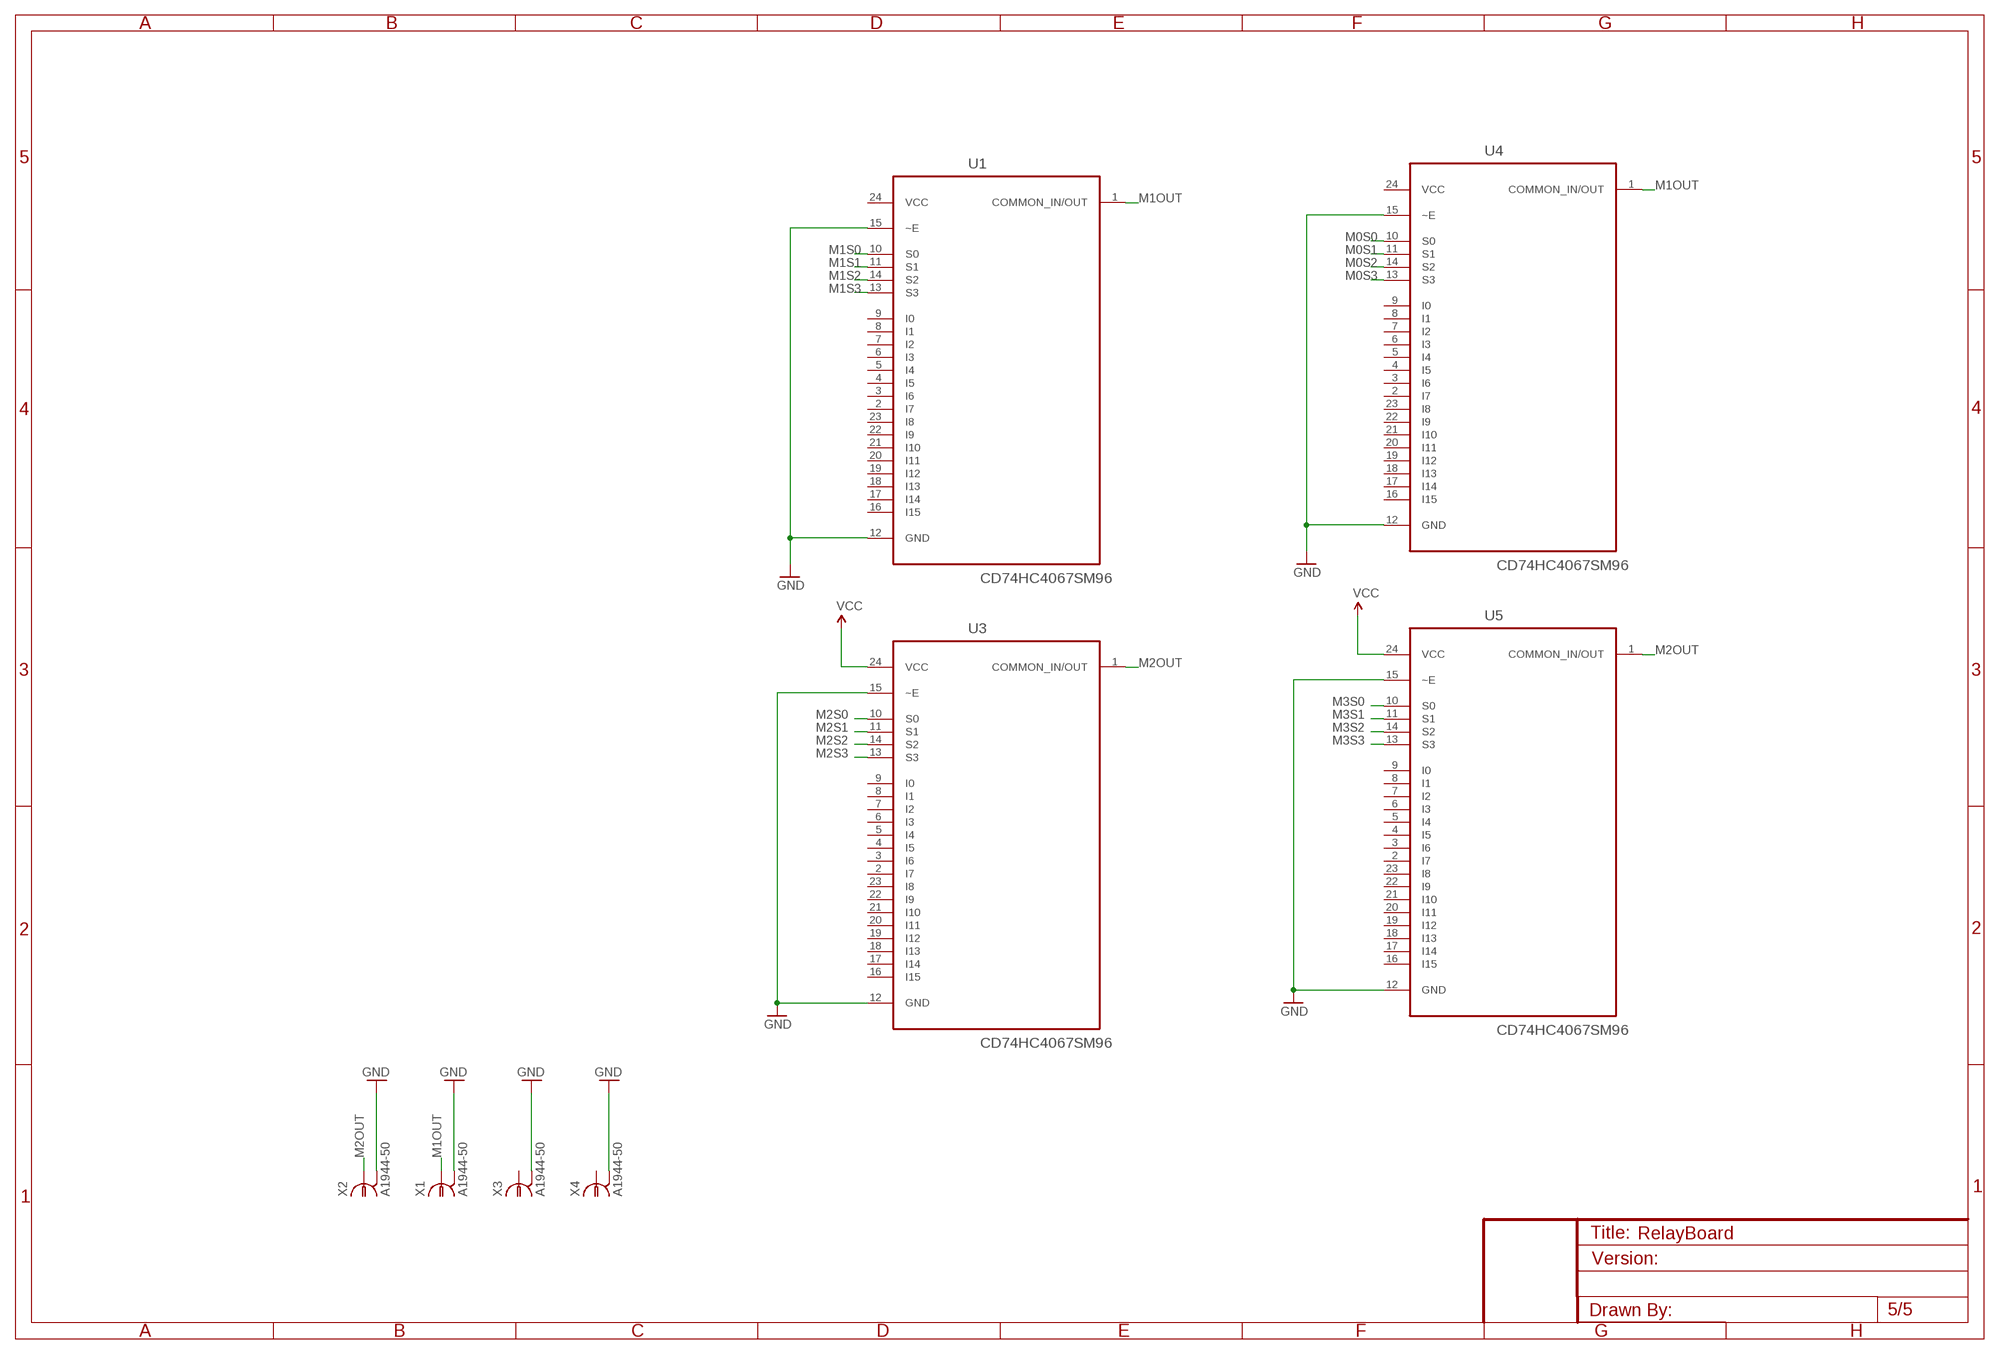
[diagram p6: schematic, sheet 5]

### Parts
U1  CD74HC4067SM96  [SOP65P780X200-24N]
U3  CD74HC4067SM96  [SOP65P780X200-24N]
U4  CD74HC4067SM96  [SOP65P780X200-24N]
U5  CD74HC4067SM96  [SOP65P780X200-24N]
X1  A1944-50  [A1944]
X2  A1944-50  [A1944]
X3  A1944-50  [A1944]
X4  A1944-50  [A1944]

### Nets
GND: U1.12(GND) U1.15(~E) U3.12(GND) U3.15(~E) U4.12(GND) U4.15(~E) U5.12(GND) U5.15(~E) X1.2 X1.3 X1.4 X1.5 X2.2 X2.3 X2.4 X2.5 X3.2 X3.3 X3.4 X3.5 X4.2 X4.3 X4.4 X4.5 ; also sheet 1,2,3,4
M0S0: U4.10(S0)
M0S1: U4.11(S1)
M0S2: U4.14(S2)
M0S3: U4.13(S3)
M1OUT: U1.1(COMMON_IN/OUT) U4.1(COMMON_IN/OUT) X1.1
M1S0: U1.10(S0)
M1S1: U1.11(S1)
M1S2: U1.14(S2)
M1S3: U1.13(S3)
M2OUT: U3.1(COMMON_IN/OUT) U5.1(COMMON_IN/OUT) X2.1
M2S0: U3.10(S0)
M2S1: U3.11(S1)
M2S2: U3.14(S2)
M2S3: U3.13(S3)
M3S0: U5.10(S0)
M3S1: U5.11(S1)
M3S2: U5.14(S2)
M3S3: U5.13(S3)
VCC: U3.24(VCC) U5.24(VCC) ; also sheet 4
Unconnected: U1.2(I7) U1.3(I6) U1.4(I5) U1.5(I4) U1.6(I3) U1.7(I2) U1.8(I1) U1.9(I0) U1.16(I15) U1.17(I14) U1.18(I13) U1.19(I12) U1.20(I11) U1.21(I10) U1.22(I9) U1.23(I8) U3.2(I7) U3.3(I6) U3.4(I5) U3.5(I4) U3.6(I3) U3.7(I2) U3.8(I1) U3.9(I0) U3.16(I15) U3.17(I14) U3.18(I13) U3.19(I12) U3.20(I11) U3.21(I10) U3.22(I9) U3.23(I8) U4.2(I7) U4.3(I6) U4.4(I5) U4.5(I4) U4.6(I3) U4.7(I2) U4.8(I1) U4.9(I0) U4.16(I15) U4.17(I14) U4.18(I13) U4.19(I12) U4.20(I11) U4.21(I10) U4.22(I9) U4.23(I8) U5.2(I7) U5.3(I6) U5.4(I5) U5.5(I4) U5.6(I3) U5.7(I2) U5.8(I1) U5.9(I0) U5.16(I15) U5.17(I14) U5.18(I13) U5.19(I12) U5.20(I11) U5.21(I10) U5.22(I9) U5.23(I8) X3.1 X4.1

## Power pins joined to a net without a drawn wire
VCC: U1.24(VCC) U4.24(VCC)

## Library data of the parts
C1-C6 C9 C10 C12-C26 C36 C39 C45 C49 = rcl:C-EU: CAPACITOR, European symbol
C11 C37 = eagle-ltspice:C: CAPACITOR, European symbol; SPICEMODEL: NONE; SPICEPREFIX: C
IC1 = microchip-dspic:MCP2551: High-Speed CAN Transceiver
ISP1 = JDT-1800_smahed:AVRISP: AVR ISP HEADER Standard 6 pin header for AVR programming
J1 J4 = MRDT-Connectors:JTAG_ARM_10PIN; PARTNO: M50-3600542
JP1 = JDT-1800_smahed:PINHD-1X6: PIN HEADER
JP2 = SparkFun-Connectors:PINHD-2X10: PIN HEADER
JP3 = JDT-1800_smahed:PINHD-1X14: PIN HEADER
JP4 = SparkFun:JUMPER-2: Jumper Basic 0.1" spaced jumper. Use with breakaway headers.
JP5 = SparkFun-Connectors:POWER_JACK: Power Jack This is the standard 5.5mm barrel jack for power. The PTH is the most common, proven, reliable, footprint. The Slot footprint only works if the mill layer is transmitted to the PCB fab house so be warned. Mating wall wart : TOL-00298 (and others); PROD_ID: CONN-08197
JP6 = pinhead:PINHD-2X30: PIN HEADER
JP7 = pinhead:PINHD-2X18: PIN HEADER
JP8 = SparkFun-Connectors:USB: USB Connectors USB-B-PTH is fully proven SKU : PRT-00139/CONN-08278 USB-miniB is fully proven SKU : PRT-00587 USB-A-PCB is untested. USB-A-H is throughly reviewed, but untested. Spark Fun Electronics SKU : PRT-00437 USB-B-SMT is throughly reviewed, but untested. Needs silkscreen touching up. USB-A-S has not been used/tested USB-MB-H has not been used/tested USB-MICROB has been used. CONN-09505; PROD_ID: CONN-08278
LED1-LED9 = JDT-1800_smahed:LED: LED OSRAM: - CHIPLED LG R971, LG N971, LY N971, LG Q971, LY Q971, LO R971, LY R971 LH N974, LH R974 LS Q976, LO Q976, LY Q976 LO Q996 - Hyper CHIPLED LW Q18S LB Q993, LB Q99A, LB R99A - SideLED LS A670, LO A670, LY A670, LG A670, LP A670 LB A673, LV A673, LT A673, LW A673 LH A674 LY A675 LS A676, LA A676, LO A676, LY A676, LW A676 LS A679, LY A679, LG A679 - Hyper Micro SIDELED® LS Y876, LA Y876, LO Y876, LY Y876 LT Y87S - SmartLED LW L88C, LW L88S LB L89C, LB L89S, LG L890 LS L89K, LO L89K, LY L89K LS L896, LA L896, LO L896, LY L896 - TOPLED LS T670, LO T670, LY T670, LG T670, LP T670 LSG T670, LSP T670, LSY T670, LOP T670, LYG T670 LG T671, LOG T671, LSG T671 LB T673, LV T673, LT T673, LW T673 LH T674 LS T676, LA T676, LO T676, LY T676, LB T676, LH T676, LSB T676, LW T676 LB T67C, LV T67C, LT T67C, LS T67K, LO T67K, LY T67K, LW E67C LS E67B, LA E67B, LO E67B, LY E67B, LB E67C, LV E67C, LT E67C LW T67C LS T679, LY T679, LG T679 LS T770, LO T770, LY T770, LG T770, LP T770 LB T773, LV T773, LT T773, LW T773 LH T774 LS E675, LA E675, LY E675, LS T675 LS T776, LA T776, LO T776, LY T776, LB T776 LHGB T686 LT T68C, LB T68C - Hyper Mini TOPLED® LB M676 - Mini TOPLED Santana® LG M470 LS M47K, LO M47K, LY M47K Source: http://www.osram.convergy.de/
R1 R38 = SparkFun-Passives:RESISTOR: Resistor Basic schematic elements and footprints for 0603, 1206, and PTH resistors.
R2 R3 R7-R10 R13-R15 R18 R19 R26-R30 R33-R37 R39-R139 = resistor:R-EU_: RESISTOR, European symbol
R5 R6 R16 R17 = JDT-1800_smahed:R-US_: RESISTOR, American symbol
R20-R25 = rcl:R-EU_: RESISTOR, European symbol
S2 = MRDT-UserInput:SWITCH_TACTILE
U1 U3-U5 = MUX:CD74HC4067SM96: 16-Channel Analog Multiplexer/Demultiplexer; MPN: CD74HC4067SM96; OC_FARNELL: 1601157; OC_NEWARK: 13N4201; PACKAGE: SOP-24; SUPPLIER: TEXAS INSTRUMENTS
U2 U6 U16 = TL1963:TL1963AKTTR.: LDO, REG, 1.5A, 1.21V TO 20V ADJ, 5TO263; MPN: TL1963AKTTR.; OC_FARNELL: 2112627; OC_NEWARK: 33R2190; PACKAGE: 5TO263; SUPPLIER: TEXAS INSTRUMENTS
U8 = MRDT-Microcontrollers:TM4C1294NCPDT
U9-U12 = INA219:INA219AIDCNR: CURRENT/POWER MONITOR; MPN: INA219AIDCNR; OC_FARNELL: 2295989; OC_NEWARK: 09P2546; PACKAGE: SOT-23-8; SUPPLIER: Texas Instruments
U13 = ftdichip:FT230X: USB to BASIC UART IC Auto generated by make-symbol-device-package-bsdl.ulp Rev. 43 Source: Data sheet <http://www.ftdichip.com/Support/Documents/DataSheets/ICs/DS_FT230X.pdf>; DESCRIPTION: IC USB SERIAL BASIC UART 16QFN; EACH: 1.53; MFPN: FT230XQ-R; MFR: FTDI; VEND: Digikey; VPN: 768-1130-1-ND
U14 = ADUM1201ARZ:ADUM1201ARZ: Dual-Channel Digital Isolators; MPN: ADUM1201ARZ; OC_FARNELL: 1078200; OC_NEWARK: 19M0753; PACKAGE: SOIC-8; SUPPLIER: Analog Devices
U$1-U$4 U$6-U$33 U$35-U$50 = SparkFun-DiscreteSemi:MMBZ27VCLT1: 40W Zener-diode transient voltage suppressor (ESD protection)
U$34 = MCP1703:MCP1703T-3302E/CB: Low Quiescent Current LDO Regulator; MPN: MCP1703T-3302E/CB; OC_FARNELL: 1439518; OC_NEWARK: 40M0637; PACKAGE: SOT-3; SUPPLIER: Microchip
X1-X4 = con-coax:A1944-50: BNC CONNECTOR 50 Ohm distributor Buerklin 78F2475; OC_FARNELL: unknown; OC_NEWARK: unknown
Y3 = MRDT-Passives:NX3225GA
Y4 = MRDT-Passives:CRYATL_32K_SMD

## Net classes
1 PP: width 0.254 mm
2 Ethernet: width 0.22 mm, clearance 0.152 mm
3 digital: width 0.152 mm
4 analog: width 0.152 mm